# Altium schematic sheet DI_DO.SchDoc
size A3; SheetNumber: 4; SheetTotal: 4
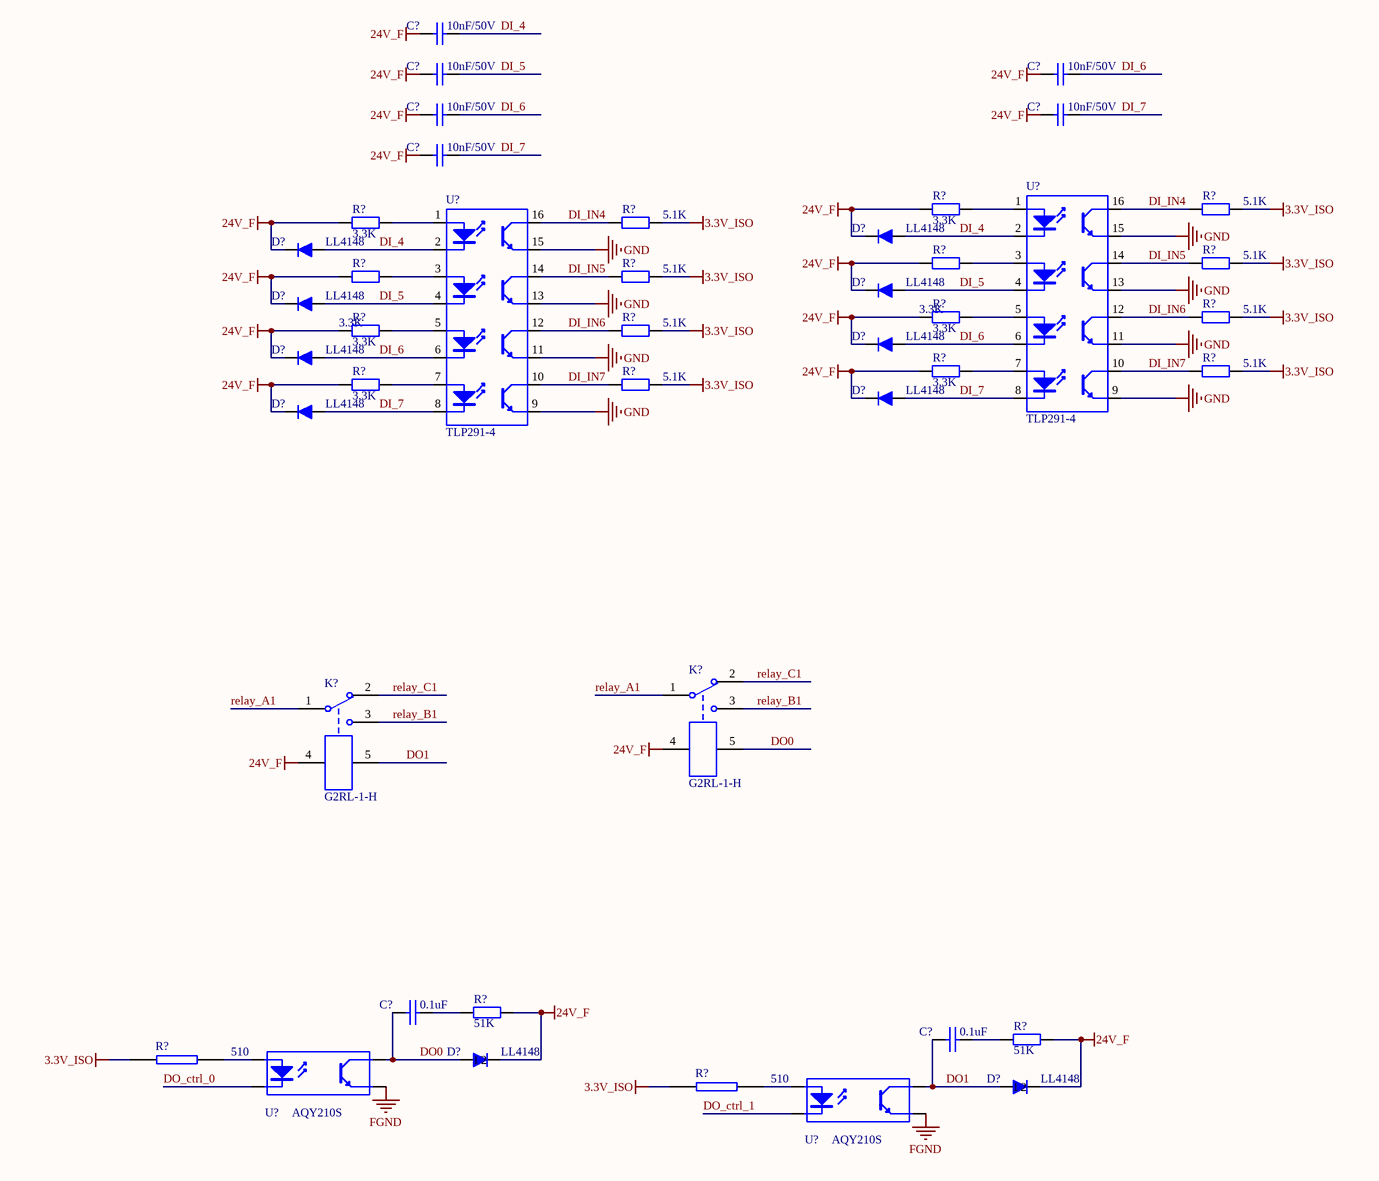
[diagram p0: DI_DO.SchDoc]

## Parts
(Parts that share a designator on the sheet are numbered #1, #2 ... from top to bottom, then left to right.)
C?#1  10nF/50V  [0603C]
C?#2  10nF/50V  [0603C]
C?#3  10nF/50V  [0603C]
C?#4  10nF/50V  [0603C]
C?#5  10nF/50V  [0603C]
C?#6  10nF/50V  [0603C]
C?#7  0.1uF  [0603C]
C?#8  0.1uF  [0603C]
D?#1  LL4148  [DO-213AB/LL34/MiniMELF]
D?#2  LL4148  [DO-213AB/LL34/MiniMELF]
D?#3  LL4148  [DO-213AB/LL34/MiniMELF]
D?#4  LL4148  [DO-213AB/LL34/MiniMELF]
D?#5  LL4148  [DO-213AB/LL34/MiniMELF]
D?#6  LL4148  [DO-213AB/LL34/MiniMELF]
D?#7  LL4148  [DO-213AB/LL34/MiniMELF]
D?#8  LL4148  [DO-213AB/LL34/MiniMELF]
D?#9  LL4148  [DO-213AB/LL34/MiniMELF]
D?#10  LL4148  [DO-213AB/LL34/MiniMELF]
K?#1  G2RL-1-H  [G2RL-1-H]
K?#2  G2RL-1-H  [G2RL-1-H]
R?#1  3.3K  [0603R]
R?#2  5.1K  [0603R]
R?#3  3.3K  [0603R]
R?#4  5.1K  [0603R]
R?#5  3.3K  [0603R]
R?#6  5.1K  [0603R]
R?#7  3.3K  [0603R]
R?#8  5.1K  [0603R]
R?#9  3.3K  [0603R]
R?#10  5.1K  [0603R]
R?#11  3.3K  [0603R]
R?#12  5.1K  [0603R]
R?#13  3.3K  [0603R]
R?#14  5.1K  [0603R]
R?#15  3.3K  [0603R]
R?#16  5.1K  [0603R]
R?#17  51K  [0603R]
R?#18  51K  [0603R]
R?#19  510  [0603R]
R?#20  510  [0603R]
U?#1  TLP291-4  [SOP16-T]
U?#2  TLP291-4  [SOP16-T]
U?#3  AQY210S  [sop4]
U?#4  AQY210S  [sop4]

## Nets
3.3V_ISO: R?#2.1 R?#4.1 R?#6.1 R?#8.1 R?#10.1 R?#12.1 R?#14.1 R?#16.1 R?#19.2 R?#20.2
24V_F: C?#1.1 C?#2.1 C?#3.1 C?#4.1 C?#5.1 C?#6.1 D?#1.2 D?#2.2 D?#3.2 D?#4.2 D?#5.2 D?#6.2 D?#7.2 D?#8.2 D?#9.2(1) D?#10.2(1) K?#1.4 K?#2.4 R?#1.2 R?#3.2 R?#5.2 R?#7.2 R?#9.2 R?#11.2 R?#13.2 R?#15.2 R?#17.2 R?#18.2
FGND: U?#3.3(E) U?#4.3(E)
GND: U?#1.9(E) U?#1.11(E) U?#1.13(E) U?#1.15(E) U?#2.9(E) U?#2.11(E) U?#2.13(E) U?#2.15(E)
DI_4: C?#1.2 D?#1.1 D?#2.1 U?#1.2(K) U?#2.2(K)
DI_5: C?#2.2 D?#3.1 D?#4.1 U?#1.4(K) U?#2.4(K)
DI_6: C?#3.2 C?#4.2 D?#5.1 D?#6.1 U?#1.6(K) U?#2.6(K)
DI_7: C?#5.2 C?#6.2 D?#7.1 D?#8.1 U?#1.8(K) U?#2.8(K)
DI_IN4: R?#2.2 R?#4.2 U?#1.16(C) U?#2.16(C)
DI_IN5: R?#6.2 R?#8.2 U?#1.14(C) U?#2.14(C)
DI_IN6: R?#10.2 R?#12.2 U?#1.12(C) U?#2.12(C)
DI_IN7: R?#14.2 R?#16.2 U?#1.10(C) U?#2.10(C)
DO0: C?#7.1 D?#9.1(2) K?#1.5 U?#3.4(C)
DO1: C?#8.1 D?#10.1(2) K?#2.5 U?#4.4(C)
DO_ctrl_0: U?#3.2(K)
DO_ctrl_1: U?#4.2(K)
relay_A1: K?#1.1 K?#2.1
relay_B1: K?#1.3 K?#2.3
relay_C1: K?#1.2 K?#2.2
NetC?#7_2: C?#7.2 R?#17.1
NetC?#8_2: C?#8.2 R?#18.1
NetR?#1_1: R?#1.1 U?#1.1(A)
NetR?#3_1: R?#3.1 U?#2.1(A)
NetR?#5_1: R?#5.1 U?#1.3(A)
NetR?#7_1: R?#7.1 U?#2.3(A)
NetR?#9_1: R?#9.1 U?#1.5(A)
NetR?#11_1: R?#11.1 U?#2.5(A)
NetR?#13_1: R?#13.1 U?#1.7(A)
NetR?#15_1: R?#15.1 U?#2.7(A)
NetR?#19_1: R?#19.1 U?#3.1(A)
NetR?#20_1: R?#20.1 U?#4.1(A)

## Library data of the parts
C?#1-C?#6 = Cap: Capacitor; Value: 22nF; Published: 8-Jun-2000; LatestRevisionDate: 17-Jul-2002; LatestRevisionNote: Re-released for DXP Platform.; PackageReference: RAD-0.3; Publisher: Altium Limited; PackageDescription: Radial Cap, Thru-Hole; 2 Leads; 0.3 in Pin Spacing
C?#7 C?#8 = CAP: Capacitor
D?#1-D?#10 = LL4148: VISHAY,LL4148,圆柱体MiniMELF100V/2A,ROHS; 版本: V1.00; 名称: 快速开关二极管; 物料编号: APLLY; 制造商: VISHAY
K?#1 K?#2 = Relay-SPDT: Single-Pole Dual-Throw Relay; Published: 24-Mar-1999; LatestRevisionDate: 17-Jul-2002; LatestRevisionNote: Re-released for DXP Platform.; PackageReference: MODULE5B; Publisher: Altium Limited
R?#1-R?#18 = Res0805M
R?#19 R?#20 = RES2
U?#1 U?#2 = TLP281-4
U?#3 U?#4 = Optoisolator1: 4-Pin Phototransistor Optocoupler; Published: 24-Mar-1999; LatestRevisionDate: 04-Mar-2005; LatestRevisionNote: Sch pins 3 & 4 Swapped.; DatasheetVersion: Nov-2003; PackageReference: DIP-4; Publisher: Altium Limited